# Altium schematic sheet ANTI-FALL-IR-SENSORs.SchDoc
size A4; SheetNumber: 19; SheetTotal: 32
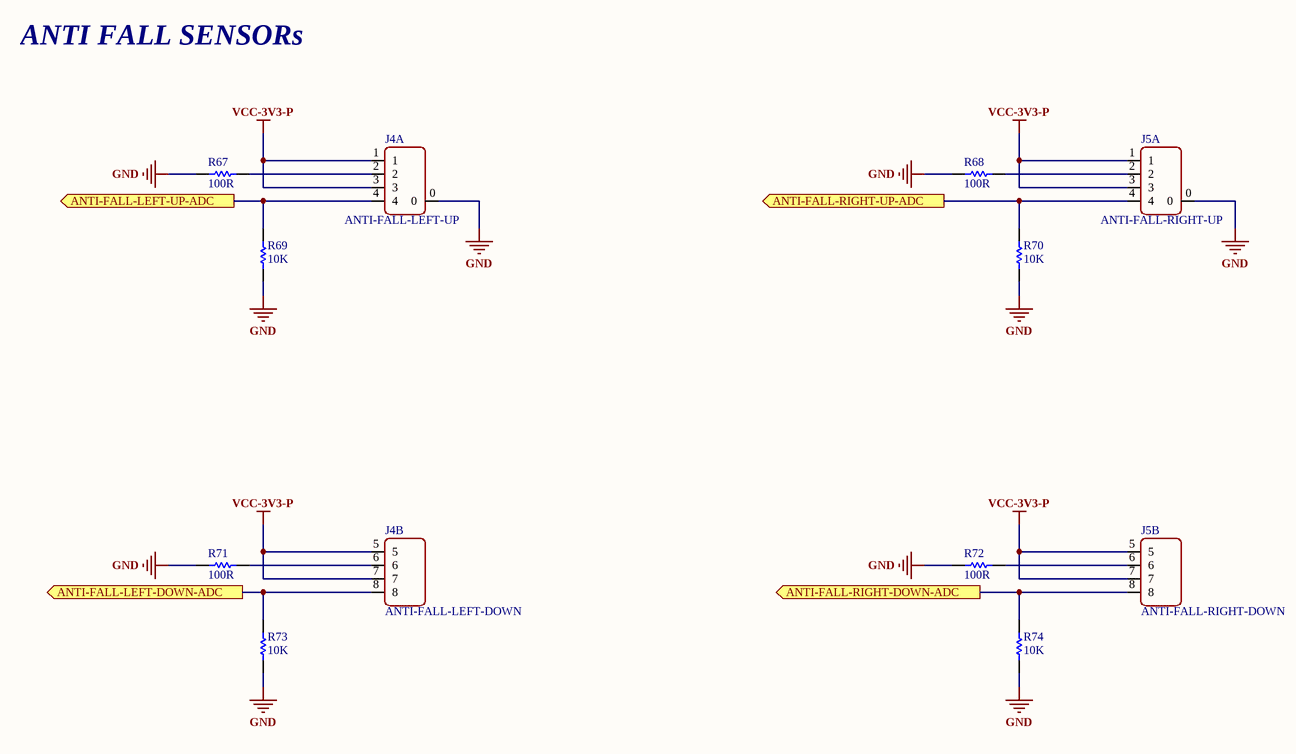
[diagram p0: ANTI-FALL-IR-SENSORs.SchDoc]

## Parts
J4  ANTI-FALL-LEFT-UP  [CONN-SMD_8P-P1.50_ZX-ZH1.5-8PWT]  (parts A,B of 2)
J5  ANTI-FALL-RIGHT-UP  [CONN-SMD_8P-P1.50_ZX-ZH1.5-8PWT]  (parts A,B of 2)
R67  100R  [RES-0402]
R68  100R  [RES-0402]
R69  10K  [RES-0402]
R70  10K  [RES-0402]
R71  100R  [RES-0402]
R72  100R  [RES-0402]
R73  10K  [RES-0402]
R74  10K  [RES-0402]

## Ports
ANTI-FALL-LEFT-DOWN-ADC (out, see Controller-RK3562-TOP[3A], STM32G070RBT6[1B]), ANTI-FALL-LEFT-UP-ADC (out, see Controller-RK3562-TOP[3A], STM32G070RBT6[1B]), ANTI-FALL-RIGHT-DOWN-ADC (out, see Controller-RK3562-TOP[3A], STM32G070RBT6[1B]), ANTI-FALL-RIGHT-UP-ADC (out, see Controller-RK3562-TOP[3A], STM32G070RBT6[1B])

## Nets
GND: J4.0 J5.0 R67.1 R68.1 R69.1 R70.1 R71.1 R72.1 R73.1 R74.1
VCC-3V3-P: J4.1 J4.3 J4.5 J4.7 J5.1 J5.3 J5.5 J5.7
ANTI-FALL-LEFT-DOWN-ADC: J4.8 R73.2 ; port ANTI-FALL-LEFT-DOWN-ADC
ANTI-FALL-LEFT-UP-ADC: J4.4 R69.2 ; port ANTI-FALL-LEFT-UP-ADC
ANTI-FALL-RIGHT-DOWN-ADC: J5.8 R74.2 ; port ANTI-FALL-RIGHT-DOWN-ADC
ANTI-FALL-RIGHT-UP-ADC: J5.4 R70.2 ; port ANTI-FALL-RIGHT-UP-ADC
NetJ4_2: J4.2 R67.2
NetJ4_6: J4.6 R71.2
NetJ5_2: J5.2 R68.2
NetJ5_6: J5.6 R72.2

## Notes on the sheet
- ANTI FALL SENSORs

## Library data of the parts
J4 J5 = HDRx8-2: ZX-ZH1.5-8PWT; Manufacturer: *; SupplierPartNumber: *; Supplier: *; VoltageRate: *
R67-R74 = Resistor-1: ManufacturingPartNumber: *; Manufacturer: *; SupplierPartNumber: *; Supplier: *; VoltageRate: *